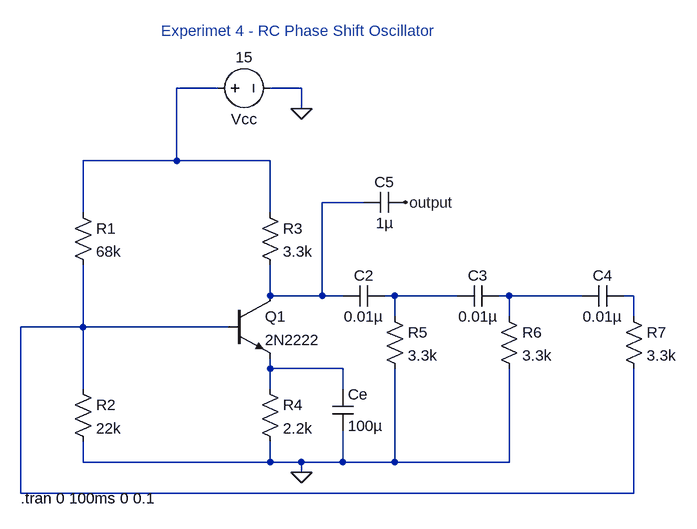
[diagram p0: schematic Experiment 4 - RC Phase Shift Oscillator.asc]
Experiment 4 - RC Phase Shift Oscillator.asc, the LTspice schematic file:
Version 4
SHEET 1 880 712
WIRE 48 64 -16 64
WIRE 176 64 128 64
WIRE 176 96 176 64
WIRE -16 176 -16 64
WIRE -16 176 -160 176
WIRE 128 176 -16 176
WIRE 272 240 208 240
WIRE -160 256 -160 176
WIRE 128 256 128 176
WIRE 128 384 128 336
WIRE 208 384 208 240
WIRE 208 384 128 384
WIRE 240 384 208 384
WIRE 320 384 304 384
WIRE 416 384 320 384
WIRE 496 384 480 384
WIRE 608 384 496 384
WIRE 688 384 672 384
WIRE 320 416 320 384
WIRE 496 416 496 384
WIRE 688 416 688 384
WIRE -160 432 -160 336
WIRE -160 432 -256 432
WIRE 64 432 -160 432
WIRE 128 496 128 480
WIRE 240 496 128 496
WIRE -160 528 -160 432
WIRE 128 528 128 496
WIRE 240 528 240 496
WIRE -160 640 -160 608
WIRE 128 640 128 608
WIRE 128 640 -160 640
WIRE 176 640 128 640
WIRE 240 640 240 592
WIRE 240 640 176 640
WIRE 320 640 320 496
WIRE 320 640 240 640
WIRE 496 640 496 496
WIRE 496 640 320 640
WIRE 176 656 176 640
WIRE -256 688 -256 432
WIRE 688 688 688 496
WIRE 688 688 -256 688
FLAG 176 96 0
FLAG 176 656 0
FLAG 336 240 output
SYMBOL voltage 32 64 R270
WINDOW 0 -32 56 VBottom 2
WINDOW 3 32 56 VTop 2
WINDOW 123 0 0 Left 0
WINDOW 39 0 0 Left 0
SYMATTR InstName Vcc
SYMATTR Value 15
SYMBOL res -176 240 R0
SYMATTR InstName R1
SYMATTR Value 68k
SYMBOL res -176 512 R0
SYMATTR InstName R2
SYMATTR Value 22k
SYMBOL res 112 240 R0
SYMATTR InstName R3
SYMATTR Value 3.3k
SYMBOL res 112 512 R0
SYMATTR InstName R4
SYMATTR Value 2.2k
SYMBOL npn 64 384 R0
SYMATTR InstName Q1
SYMATTR Value 2N2222
SYMBOL res 304 400 R0
SYMATTR InstName R5
SYMATTR Value 3.3k
SYMBOL res 480 400 R0
SYMATTR InstName R6
SYMATTR Value 3.3k
SYMBOL res 672 400 R0
SYMATTR InstName R7
SYMATTR Value 3.3k
SYMBOL cap 224 528 R0
SYMATTR InstName Ce
SYMATTR Value 100µ
SYMBOL cap 304 368 R90
WINDOW 0 0 32 VBottom 2
WINDOW 3 32 32 VTop 2
SYMATTR InstName C2
SYMATTR Value 0.01µ
SYMBOL cap 480 368 R90
WINDOW 0 0 32 VBottom 2
WINDOW 3 32 32 VTop 2
SYMATTR InstName C3
SYMATTR Value 0.01µ
SYMBOL cap 672 368 R90
WINDOW 0 0 32 VBottom 2
WINDOW 3 32 32 VTop 2
SYMATTR InstName C4
SYMATTR Value 0.01µ
SYMBOL cap 336 224 R90
WINDOW 0 0 32 VBottom 2
WINDOW 3 32 32 VTop 2
SYMATTR InstName C5
SYMATTR Value 1µ
TEXT -256 696 Left 2 !.tran 0 100ms 0 0.1
TEXT -40 -24 Left 2 ;Experimet 4 - RC Phase Shift Oscillator

The netlist it stands for:
* Experiment 4 - RC Phase Shift Oscillator.asc
Vcc N001 0 15
R1 N001 N006 68k
R2 N006 0 22k
R3 N001 N002 3.3k
R4 N007 0 2.2k
Q1 N002 N006 N007 0 2N2222
R5 N003 0 3.3k
R6 N004 0 3.3k
R7 N005 N006 3.3k
Ce N007 0 100µ
C2 N003 N002 0.01µ
C3 N004 N003 0.01µ
C4 N005 N004 0.01µ
C5 output N002 1µ
.model NPN NPN
.model PNP PNP
.lib standard.bjt
.tran 0 100ms 0 0.1
* Experimet 4 - RC Phase Shift Oscillator
.backanno
.end